# Altium schematic sheet ISOLATED_PS.SchDoc: AI ARTIQ Driver
size 420 x 297 mm; Author: G.Kasprowicz; CompanyName: CTI; Organization: CTI; Address1: CTI; Address2: Nowowiejska 15/19 00-665 Warsaw; Address3: gkasprow@gmail.com; DocumentNumber: 5; Revision: 1.0; SheetNumber: 5; SheetTotal: 11; ModifiedBy: -; CheckedDate: -; Title2: ISOLATED PS; DivGrp: CTI; ModifiedDate: -; ProjectName: Sensor Box
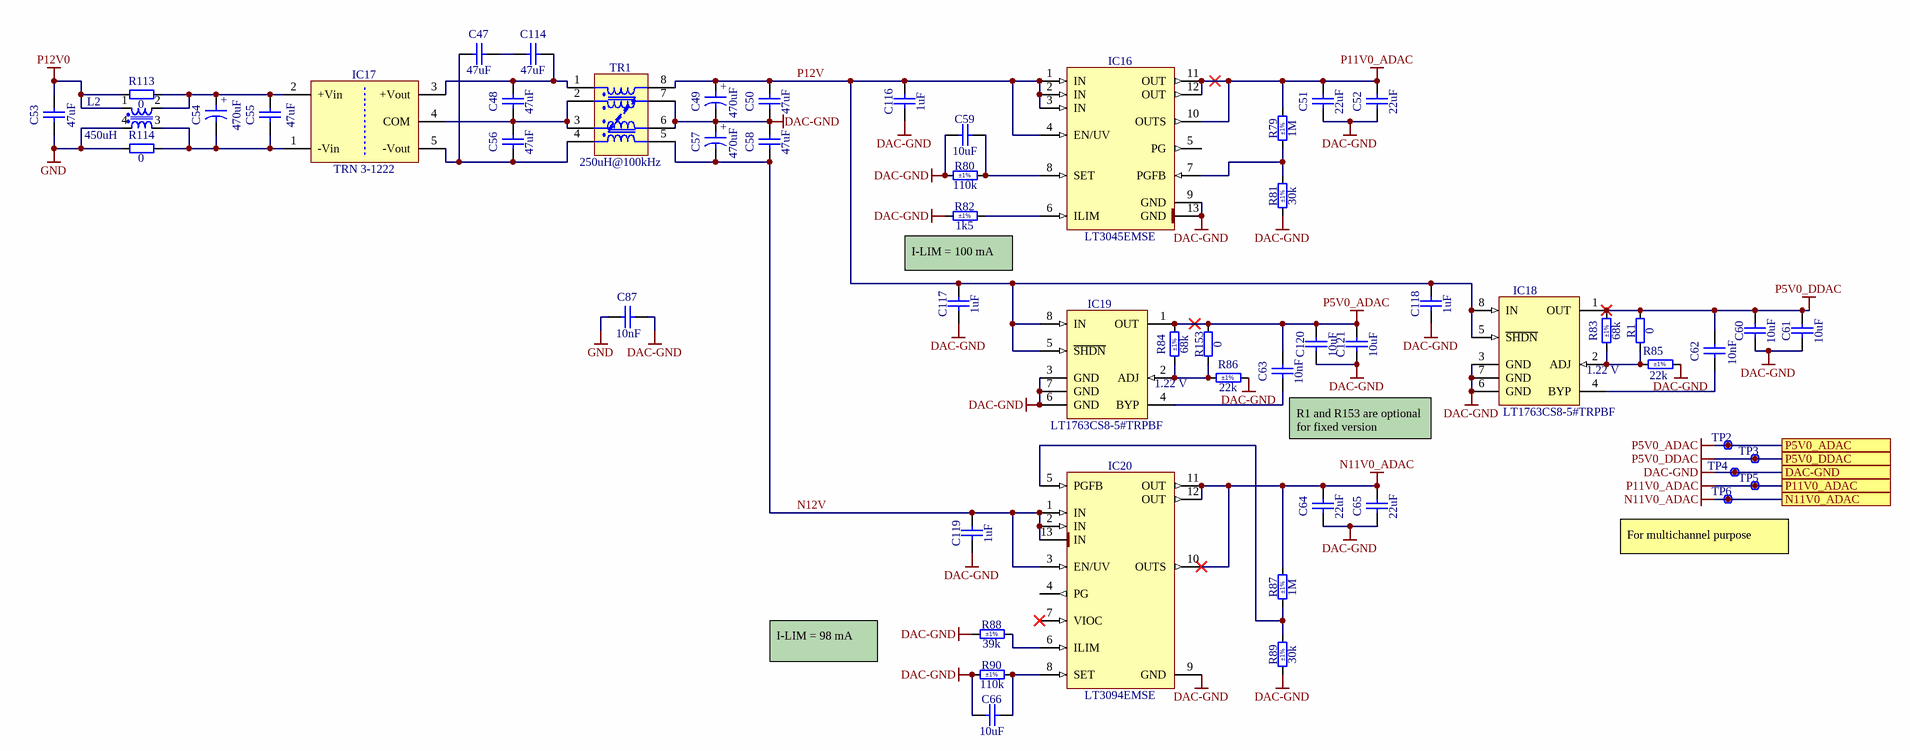
[diagram p0: ISOLATED_PS.SchDoc]

## Parts
C47  47uF  [CAPC3225X270N]
C48  47uF  [CAPC3225X270N]
C49  470uF  [CAPAE1030X1020N]
C50  47uF  [CAPC3225X270N]
C51  22uF  [CAPC3216X180N]
C52  22uF  [CAPC3216X180N]
C53  47uF  [CAPC3225X270N]
C54  470uF  [CAPAE1030X1020N]
C55  47uF  [CAPC3225X270N]
C56  47uF  [CAPC3225X270N]
C57  470uF  [CAPAE1030X1020N]
C58  47uF  [CAPC3225X270N]
C59  10uF  [CAPC2012X135N]
C60  10uF  [CAPC2012X135N]
C61  10uF  [CAPC2012X135N]
C62  10nF  [CAPC1608X87N]
C63  10nF  [CAPC1608X87N]
C64  22uF  [CAPC3216X180N]
C65  22uF  [CAPC3216X180N]
C66  10uF  [CAPC2012X135N]
C87  10nF  [CAPC1608X87N]
C114  47uF  [CAPC3225X270N]
C116  1uF  [CAPC1005X55N]
C117  1uF  [CAPC1005X55N]
C118  1uF  [CAPC1005X55N]
C119  1uF  [CAPC1005X55N]
C120  10uF  [CAPC2012X135N]
C121  10uF  [CAPC2012X135N]
IC16  LT3045EMSE  [SOP65P490X110-13N-R175X294]
IC17  TRN 3-1222  [DCDC_TRACO_TRN3]
IC18  LT1763CS8-5#TRPBF  [SOIC127P600X175-8N]
IC19  LT1763CS8-5#TRPBF  [SOIC127P600X175-8N]
IC20  LT3094EMSE  [SOP65P490X110-13N-R175X294]
L2  450uH  [CMDC-9260-6500]
R1  0  [RESC1608X55N]
R79  1M  Tolerance: ±1%  [RESC1005X40N]
R80  110k  Tolerance: ±1%  [RESC1005X40N]
R81  30k  Tolerance: ±1%  [RESC1005X40N]
R82  1k5  Tolerance: ±1%  [RESC1005X40N]
R83  68k  Tolerance: ±1%  [RESC1608X55N]
R84  68k  Tolerance: ±1%  [RESC1608X55N]
R85  22k  Tolerance: ±1%  [RESC1608X55N]
R86  22k  Tolerance: ±1%  [RESC1608X55N]
R87  1M  Tolerance: ±1%  [RESC1005X40N]
R88  39k  Tolerance: ±1%  [RESC1005X40N]
R89  30k  Tolerance: ±1%  [RESC1005X40N]
R90  110k  Tolerance: ±1%  [RESC1005X40N]
R113  0  [RESC2012X60N]
R114  0  [RESC2012X60N]
R153  0  [RESC1608X55N]
TP2  Test Point  [TPS127]  (value not drawn)  (no BOM)
TP3  Test Point  [TPS127]  (value not drawn)  (no BOM)
TP4  Test Point  [VERO_20-313145]  (value not drawn)
TP5  Test Point  [TPS127]  (value not drawn)  (no BOM)
TP6  Test Point  [TPS127]  (value not drawn)  (no BOM)
TR1  250uH@100kHz  [IND_WURTH_WE-SL_74420]

## Ports
DAC-GND, N11V0_ADAC, P5V0_ADAC, P5V0_DDAC, P11V0_ADAC

## Nets
DAC-GND: C49.2 C50.1 C51.1 C52.1 C57.1 C58.2 C59.1 C60.1 C61.1 C64.1 C65.1 C66.1 C87.2 C116.1 C117.1 C118.1 C119.1 C120.1 C121.1 IC16.9(GND) IC16.13(GND) IC18.3(GND) IC18.6(GND) IC18.7(GND) IC19.3(GND) IC19.6(GND) IC19.7(GND) IC20.9(GND) R80.1 R81.1 R82.1 R85.1 R86.1 R88.1 R89.1 R90.1 TP4.1 TR1.6 TR1.7 ; port DAC-GND
GND: C53.2 C87.1 L2.4 R114.1
N11V0_ADAC: C64.2 C65.2 IC20.10(OUTS) IC20.11(OUT) IC20.12(OUT) R87.2 TP6.1 ; port N11V0_ADAC
P5V0_ADAC: C63.2 C120.2 C121.2 IC19.1(OUT) R84.2 R153.2 TP2.1 ; port P5V0_ADAC
P5V0_DDAC: C60.2 C61.2 C62.2 IC18.1(OUT) R1.2 R83.2 TP3.1 ; port P5V0_DDAC
P11V0_ADAC: C51.2 C52.2 IC16.10(OUTS) IC16.11(OUT) IC16.12(OUT) R79.2 TP5.1 ; port P11V0_ADAC
P12V0: C53.1 L2.1 R113.1
N12V: C57.2 C58.1 C119.2 IC20.1(IN) IC20.2(IN) IC20.3(EN/UV) IC20.13(IN) TR1.5
P12V: C49.1 C50.2 C116.2 C117.2 C118.2 IC16.1(IN) IC16.2(IN) IC16.3(IN) IC16.4(EN/UV) IC18.5(~{SHDN}) IC18.8(IN) IC19.5(~{SHDN}) IC19.8(IN) TR1.8
NetC47_1: C47.1 C56.1 IC17.5(-Vout) TR1.4
NetC47_2: C47.2 C114.1
NetC48_1: C48.1 C56.2 IC17.4(COM) TR1.2 TR1.3
NetC48_2: C48.2 C114.2 IC17.3(+Vout) TR1.1(NC)
NetC54_1: C54.1 C55.1 IC17.2(+Vin) L2.2 R113.2
NetC54_2: C54.2 C55.2 IC17.1(-Vin) L2.3 R114.2
NetC59_2: C59.2 IC16.8(SET) R80.2
NetC62_1: C62.1 IC18.4(BYP)
NetC63_1: C63.1 IC19.4(BYP)
NetC66_2: C66.2 IC20.8(SET) R90.2
NetIC16_6: IC16.6(ILIM) R82.2
NetIC16_7: IC16.7(PGFB) R79.1 R81.2
NetIC18_2: IC18.2(ADJ) R1.1 R83.1 R85.2
NetIC19_2: IC19.2(ADJ) R84.1 R86.2 R153.1
NetIC20_5: IC20.5(PGFB) R87.1 R89.2
NetIC20_6: IC20.6(ILIM) R88.2

Not connected (* = marked no-connect by the designer): IC16 5(PG); IC20 4(PG) 7(VIOC)*

## Notes on the sheet
- I-LIM = 100 mA
- (near IC19) 1.22 V
- (near IC18) 1.22 V
- (near C63) R1 and R153 are optional for fixed version
- For multichannel purpose
- I-LIM = 98 mA
- Project/Equipment
- Document
- Designer
- Drawn by
- Check.by
- Copyright 2018.
  This documentation describes Open Hardware and is licensed under the CERN OHL v.1.1. You may redistribute and modify this documentation under the terms of the CERN OHL v.1.1. (http://ohwr.org/CERNOHL). This documentation is distributed WITHOUT ANY EXPRESS OR IMPLIED WARRANTY, INCLUDING OF MERCHANTABILITY, SATISFACTORY QUALITY AND FITNESS FOR A PARTICULAR PURPOSE. Please see the CERN OHL v.1.1 for applicable conditions.
- Contact
- File
- Last Mod.
- Print Date
- Sheet
- Size
- A3
- of
- Rev
- (in symbol CAE1030-1020_470UF_25V_20%) +

## Library data of the parts
C47 C48 C50 C53 C55 C56 C58 C114 = CC1210_47UF_16V_20%_X5R: Non-polarised capacitor; Part Description: SMD Multilayer Chip Ceramic Capacitor; Manufacturer: GENERIC; Manufacturer1 Part Number: EMK325BJ476MM-T; Voltage: 16V; TC: X5R; Tolerance: ±20%; Part Number: CC1210_47UF_16V_20%_X5R; Component Kind: Standard; Component Type: Standard; Pin Count: 2; Value: 47uF; Status: None; Manufacturer Part Number: CC1210_47UF_16V_20%_X5R; Case: 1210; Mounted: Yes; Socket: No; SMD: Yes; Sense: No; Manufacturer1 Example: TAIYO YUDEN; Manufacturer1 ComponentHeight: 2.7mm; HelpURL: \\cern.ch\dfs\Applications\Altium\Datasheets\CC1210_X5R_TAIYO-YUDEN_HIGH-VALUE.pdf; Author: CERN DEM MR; CreateDate: 03.02.2016; LatestRevisionDate: 03.02.2016
C49 C54 C57 = CAE1030-1020_470UF_25V_20%: Polarised capacitor; Part Description: Aluminum Electrolytic SMT Capacitor; Manufacturer: PANASONIC; Manufacturer Part Number: EEEFK1E471AP; Voltage: 25V; Tolerance: ±20%; Part Number: CAE1030-1020_470UF_25V_20%; Component Kind: Standard; Component Type: Standard; Pin Count: 2; Value: 470uF; Status: Not Recommended; Case: G; Mounted: Yes; Socket: No; SMD: Yes; Sense: No; ComponentHeight: 10.2mm; HelpURL: \\cern.ch\dfs\Applications\Altium\Datasheets\CAE_PANASONIC_FK-V.pdf; Author: CERN DEM JLC; CreateDate: 03.12.2007; LatestRevisionDate: 05.11.2014
C51 C52 C64 C65 = CC1206_22UF_35V_20%_JB_TDK_C3216JB1V226M160AC: Non-polarised capacitor; Part Description: SMD Multilayer Chip Ceramic Capacitor; Manufacturer: TDK; Voltage: 35V; TC: JB(±10%); Tolerance: ±20%; Part Number: CC1206_22UF_35V_20%_JB_TDK_C3216JB1V226M160AC; Component Kind: Standard; Component Type: Standard; Pin Count: 2; Value: 22uF; Status: None; Manufacturer Part Number: C3216JB1V226M160AC; Case: 1206; Mounted: Yes; Socket: No; SMD: Yes; Sense: No; ComponentHeight: 1.8mm; HelpURL: \\cern.ch\dfs\Applications\Altium\Datasheets\CC1206_TDK_C3216JB1V226M160AC.pdf; Author: CERN DEM JLC; CreateDate: 13.07.2017; LatestRevisionDate: 13.07.2017
C59-C61 C66 C120 C121 = CC0805_10UF_16V_10%_X5R: Non-polarised capacitor; Part Description: SMD Multilayer Chip Ceramic Capacitor; Manufacturer: GENERIC; Manufacturer1 Part Number: C0805C106K4PAC; Voltage: 16V; TC: X5R; Tolerance: ±10%; Part Number: CC0805_10UF_16V_10%_X5R; Component Kind: Standard; Component Type: Standard; Pin Count: 2; Value: 10uF; Status: Preferred; Manufacturer Part Number: CC0805_10UF_16V_10%_X5R; Case: 0805; Mounted: Yes; Socket: No; SMD: Yes; Sense: No; Manufacturer1 Example: KEMET; Manufacturer1 ComponentHeight: 1.4mm; HelpURL: \\cern.ch\dfs\Applications\Altium\Datasheets\CC1206_X5R_KEMET.pdf; Author: CERN DEM JLC; CreateDate: 03.12.2007; LatestRevisionDate: 03.12.2007
C62 C63 C87 = CC0603_10NF_50V_5%_C0G: Non-polarised capacitor; Part Description: SMD Multilayer Chip Ceramic Capacitor; Manufacturer: GENERIC; Manufacturer1 Part Number: C1608C0G1H103J080AA; Voltage: 50V; TC: C0G/NP0; Tolerance: ±5%; Part Number: CC0603_10NF_50V_5%_C0G; Component Kind: Standard; Component Type: Standard; Pin Count: 2; Value: 10nF; Status: Preferred; Manufacturer Part Number: CC0603_10NF_50V_5%_C0G; Case: 0603; Mounted: Yes; Socket: No; SMD: Yes; Sense: No; Manufacturer1 Example: TDK; Manufacturer1 ComponentHeight: 0.9mm; HelpURL: \\cern.ch\dfs\Applications\Altium\Datasheets\CC0603_C0G_TDK_C.pdf; Author: CERN DEM JLC; CreateDate: 10.12.2014; LatestRevisionDate: 10.12.2014
C116-C119 = CC0402_1UF_16V_10%_X5R: Non-polarised capacitor; Part Description: SMD Multilayer Chip Ceramic Capacitor; Manufacturer: GENERIC; Manufacturer1 Part Number: C1005X5R1C105KT; Voltage: 16V; TC: X5R; Tolerance: ±10%; Part Number: CC0402_1UF_16V_10%_X5R; Component Kind: Standard; Component Type: Standard; Pin Count: 2; Value: 1uF; Status: Preferred; Manufacturer Part Number: CC0402_1UF_16V_10%_X5R; Case: 0402; Mounted: Yes; Socket: No; SMD: Yes; Sense: No; Manufacturer1 Example: TDK; Manufacturer1 ComponentHeight: 0.55mm; HelpURL: \\cern.ch\dfs\Applications\Altium\Datasheets\CC0402_X5R_TDK_C.pdf; Author: CERN DEM JLC; CreateDate: 25.10.2012; LatestRevisionDate: 25.10.2012
IC16 = LT3045EMSE: 20V, 500mA, Ultralow Noise, Ultrahigh PSRR Linear Regulator; Manufacturer: LINEAR TECHNOLOGY; PressFit: No; Bonding: No; Part Number: LT3045EMSE; Component Kind: Standard; Component Type: Standard; Device: LT3045EMSE; PackageDescription: SOP, 0.65mm Pitch; 12 Pin, 3.00mm W X 4.039mm L X 1.10mm H body (w/Thermal Tab 1.75 X 2.94 mm), IPC Medium Density; Part Description: 20V, 500mA, Ultralow Noise, Ultrahigh PSRR Linear Regulator; Manufacturer Part Number: LT3045EMSE; Pin Count: 13; Case: MSOP12; Mounted: Yes; Socket: No; SMD: Yes; Sense: No; ComponentHeight: 1.1mm; HelpURL: \\cern.ch\dfs\Applications\Altium\Datasheets\LT3045.pdf; Author: CERN DEM HF; CreateDate: 18.05.2022; LatestRevisionDate: 18.05.2022
IC17 = TRN 3-1222: TRACO, TRN 3 Serie, Dual Output DCDC Converter; Part Description: 9-18VDC to ±12V, Iout (max) ±125mA, 3W DC-DC Converter; Manufacturer: TRACO POWER; PressFit: No; Bonding: No; Part Number: TRN 3-1222; Component Kind: Standard; Component Type: Standard; Device: TRN 3-1222; PackageDescription: TRN 3 Series , Body 11.9 x 7.7mm; Manufacturer Part Number: TRN 3-1222; Pin Count: 5; Mounted: Yes; Socket: No; SMD: No; Sense: No; ComponentHeight: 11.5mm; HelpURL: \\cern.ch\dfs\Applications\Altium\Datasheets\TRN 3-1222.pdf; Author: CERN DEM JLC; CreateDate: 06.06.2017; LatestRevisionDate: 06.06.2017
IC18 IC19 = LT1763CS8: 1.22V to 20V 500mA, Low Noise, LDO Adjustable Micropower Regulator; Part Description: 1.22V to 20V, 500mA, Low Noise, LDO Adjustable Micropower Regulator; Manufacturer: LINEAR TECHNOLOGY; PressFit: No; Bonding: No; Part Number: LT1763CS8; Component Kind: Standard; Component Type: Standard; Device: LT1763CS8; PackageDescription: SOIC 8, Pitch 1.27mm, Body 4x5mm, IPC Medium Density; Manufacturer Part Number: LT1763CS8; Pin Count: 8; Case: SOIC8; Mounted: Yes; Socket: No; SMD: Yes; Sense: No; ComponentHeight: 1.75mm; HelpURL: \\cern.ch\dfs\Applications\Altium\Datasheets\LT1763CS8#PBF.pdf; Author: CERN DEM JLC; CreateDate: 11.01.2010; LatestRevisionDate: 16.03.2021
IC20 = LT3094EMSE#PBF: -20V, 500mA, Ultralow Noise, Ultrahigh PSRR Negative Linear Regulator; Manufacturer: LINEAR TECHNOLOGY; PressFit: No; Bonding: No; Part Number: LT3094EMSE#PBF; Component Kind: Standard; Component Type: Standard; Device: LT3094EMSE; PackageDescription: SOP, 0.65mm Pitch; 12 Pin, 3.00mm W X 4.039mm L X 1.10mm H body (w/Thermal Tab 1.75 X 2.94 mm), IPC Medium Density; Part Description: -20V, 500mA, Ultralow Noise, Ultrahigh PSRR Negative Linear Regulator; Manufacturer Part Number: LT3094EMSE#PBF; Pin Count: 13; Case: MSOP12; Mounted: Yes; Socket: No; SMD: Yes; Sense: No; ComponentHeight: 1.1mm; HelpURL: \\cern.ch\dfs\Applications\Altium\Datasheets\LT3094EMSE#PBF.pdf; Author: CERN DEM JLC; CreateDate: 12.11.2018; LatestRevisionDate: 12.11.2018
L2 = IND_450UH_35%_TRACO_TCK-048: Inductor Common Mode; Part Description: Common Mode Choke TCK-048; Manufacturer: TRACO POWER; Power: 5.2A; Resistance: 0.025R; Tolerance: ±35%; Part Number: IND_450UH_35%_TRACO_TCK-048; Component Kind: Standard; Component Type: Standard; Footprint: IND_TRACO_TCK-048; Pin Count: 4; Value: 450uH; Manufacturer Part Number: TCK-048; Mounted: Yes; Socket: No; SMD: No; Sense: No; ComponentHeight: 9.8mm; HelpURL: \\cern.ch\dfs\Applications\Altium\Datasheets\IND_TRACO_TCK-048.pdf; Author: CERN DEM MR; CreateDate: 28.01.2016; LatestRevisionDate: 03.10.2019
R1 R153 = R0603_0R_JUMPER: Resistor; Part Description: 1A (0.05R Max DC Resistance) Zero Ohm Jumper; Manufacturer: GENERIC; Manufacturer1 Part Number: NRC06Z0; PressFit: No; Part Number: R0603_0R_JUMPER; Component Kind: Standard; Component Type: Standard; Pin Count: 2; Value: 0; Status: Preferred; Manufacturer Part Number: R0603_0R_JUMPER; Case: 0603; Mounted: Yes; Sense: No; Socket: No; SMD: Yes; Manufacturer1 Example: NIC COMPONENT; Manufacturer1 ComponentHeight: 0.55mm; HelpURL: \\cern.ch\dfs\Applications\Altium\Datasheets\R0603_NIC_NRC.pdf; Author: CERN DEM JLC; CreateDate: 03.12.2007; LatestRevisionDate: 13.03.2008
R79 R87 = R0402_1M_1%_0.0625W_100PPM: Resistor - 1%; Part Description: General Purpose Thick Film Chip Resistor; Manufacturer: GENERIC; Manufacturer1 Part Number: 232270671005L; TC: ±100ppm/°C; PressFit: No; Part Number: R0402_1M_1%_0.0625W_100PPM; Component Kind: Standard; Component Type: Standard; Pin Count: 2; Value: 1M; Status: Not Recommended; Power: 0.0625W; Manufacturer Part Number: R0402_1M_1%_0.0625W_100PPM; Case: 0402; Mounted: Yes; Sense: No; Socket: No; SMD: Yes; Manufacturer1 Example: YAGEO PHYCOMP; Manufacturer1 ComponentHeight: 0.4mm; HelpURL: \\cern.ch\dfs\Applications\Altium\Datasheets\R0402_Phycomp_RC0402.pdf; Author: CERN DEM JLC; CreateDate: 03.12.2007; LatestRevisionDate: 17.10.2012
R80 R90 = R0402_110K_1%_0.0625W_100PPM: Resistor - 1%; Part Description: General Purpose Thick Film Chip Resistor; Manufacturer: GENERIC; Manufacturer1 Part Number: 232270671104L; TC: ±100ppm/°C; PressFit: No; Part Number: R0402_110K_1%_0.0625W_100PPM; Component Kind: Standard; Component Type: Standard; Pin Count: 2; Value: 110k; Status: Not Recommended; Power: 0.0625W; Manufacturer Part Number: R0402_110K_1%_0.0625W_100PPM; Case: 0402; Mounted: Yes; Sense: No; Socket: No; SMD: Yes; Manufacturer1 Example: YAGEO PHYCOMP; Manufacturer1 ComponentHeight: 0.4mm; HelpURL: \\cern.ch\dfs\Applications\Altium\Datasheets\R0402_Phycomp_RC0402.pdf; Author: CERN DEM JLC; CreateDate: 03.12.2007; LatestRevisionDate: 17.10.2012
R81 R89 = R0402_30K_1%_0.0625W_100PPM: Resistor - 1%; Part Description: General Purpose Thick Film Chip Resistor; Manufacturer: GENERIC; Manufacturer1 Part Number: 232270673003L; TC: ±100ppm/°C; PressFit: No; Part Number: R0402_30K_1%_0.0625W_100PPM; Component Kind: Standard; Component Type: Standard; Pin Count: 2; Value: 30k; Status: Not Recommended; Power: 0.0625W; Manufacturer Part Number: R0402_30K_1%_0.0625W_100PPM; Case: 0402; Mounted: Yes; Sense: No; Socket: No; SMD: Yes; Manufacturer1 Example: YAGEO PHYCOMP; Manufacturer1 ComponentHeight: 0.4mm; HelpURL: \\cern.ch\dfs\Applications\Altium\Datasheets\R0402_Phycomp_RC0402.pdf; Author: CERN DEM JLC; CreateDate: 03.12.2007; LatestRevisionDate: 17.10.2012
R82 = R0402_1K5_1%_0.0625W_100PPM: Resistor - 1%; Part Description: General Purpose Thick Film Chip Resistor; Manufacturer: GENERIC; Manufacturer1 Part Number: 232270671502L; TC: ±100ppm/°C; PressFit: No; Part Number: R0402_1K5_1%_0.0625W_100PPM; Component Kind: Standard; Component Type: Standard; Pin Count: 2; Value: 1k5; Status: Not Recommended; Power: 0.0625W; Manufacturer Part Number: R0402_1K5_1%_0.0625W_100PPM; Case: 0402; Mounted: Yes; Sense: No; Socket: No; SMD: Yes; Manufacturer1 Example: YAGEO PHYCOMP; Manufacturer1 ComponentHeight: 0.4mm; HelpURL: \\cern.ch\dfs\Applications\Altium\Datasheets\R0402_Phycomp_RC0402.pdf; Author: CERN DEM JLC; CreateDate: 03.12.2007; LatestRevisionDate: 17.10.2012
R83 R84 = R0603_68K_1%_0.1W_100PPM: Resistor - 1%; Part Description: General Purpose Thick Film Chip Resistor; Manufacturer: GENERIC; Manufacturer1 Part Number: NRC06F6802TRF; Power: 0.1W; TC: ±100ppm/°C; PressFit: No; Part Number: R0603_68K_1%_0.1W_100PPM; Component Kind: Standard; Component Type: Standard; Pin Count: 2; Value: 68k; Status: Preferred; Manufacturer Part Number: R0603_68K_1%_0.1W_100PPM; Case: 0603; Mounted: Yes; Sense: No; Socket: No; SMD: Yes; Manufacturer1 Example: NIC COMPONENT; Manufacturer1 ComponentHeight: 0.55mm; HelpURL: \\cern.ch\dfs\Applications\Altium\Datasheets\R0603_NIC_NRC.pdf; Author: CERN DEM JLC; CreateDate: 03.12.2007; LatestRevisionDate: 13.03.2008
R85 R86 = R0603_22K_1%_0.1W_100PPM: Resistor - 1%; Part Description: General Purpose Thick Film Chip Resistor; Manufacturer: GENERIC; Manufacturer1 Part Number: NRC06F2202TRF; Power: 0.1W; TC: ±100ppm/°C; PressFit: No; Part Number: R0603_22K_1%_0.1W_100PPM; Component Kind: Standard; Component Type: Standard; Pin Count: 2; Value: 22k; Status: Preferred; Manufacturer Part Number: R0603_22K_1%_0.1W_100PPM; Case: 0603; Mounted: Yes; Sense: No; Socket: No; SMD: Yes; Manufacturer1 Example: NIC COMPONENT; Manufacturer1 ComponentHeight: 0.55mm; HelpURL: \\cern.ch\dfs\Applications\Altium\Datasheets\R0603_NIC_NRC.pdf; Author: CERN DEM JLC; CreateDate: 03.12.2007; LatestRevisionDate: 13.03.2008
R88 = R0402_39K_1%_0.0625W_100PPM: Resistor - 1%; Part Description: General Purpose Thick Film Chip Resistor; Manufacturer: GENERIC; Manufacturer1 Part Number: 232270673903; TC: ±100ppm/°C; PressFit: No; Part Number: R0402_39K_1%_0.0625W_100PPM; Component Kind: Standard; Component Type: Standard; Pin Count: 2; Value: 39k; Status: Not Recommended; Power: 0.0625W; Manufacturer Part Number: R0402_39K_1%_0.0625W_100PPM; Case: 0402; Mounted: Yes; Sense: No; Socket: No; SMD: Yes; Manufacturer1 Example: YAGEO PHYCOMP; Manufacturer1 ComponentHeight: 0.4mm; HelpURL: \\cern.ch\dfs\Applications\Altium\Datasheets\R0402_Phycomp_RC0402.pdf; Author: CERN DEM JLC; CreateDate: 03.12.2007; LatestRevisionDate: 17.10.2012
R113 R114 = R0805_0R_JUMPER: Resistor; Part Description: 2A (0.05R Max DC Resistance) Zero Ohm Jumper; Manufacturer: GENERIC; Manufacturer1 Part Number: NRC10Z0; PressFit: No; Part Number: R0805_0R_JUMPER; Component Kind: Standard; Component Type: Standard; Pin Count: 2; Value: 0; Status: Preferred; Manufacturer Part Number: R0805_0R_JUMPER; Case: 0805; Mounted: Yes; Sense: No; Socket: No; SMD: Yes; Manufacturer1 Example: NIC COMPONENT; Manufacturer1 ComponentHeight: 0.6mm; HelpURL: \\cern.ch\dfs\Applications\Altium\Datasheets\R0805_NIC_NRC.pdf; Author: CERN DEM JLC; CreateDate: 03.12.2007; LatestRevisionDate: 13.03.2008
TP2 TP3 TP5 TP6 = SMD_PAD_1.27X1.27MM: Part Description: 1.27mm x 1.27mm PCB Copper Area (SMD Test Point); Mounted: No; Part Number: SMD_PAD_1.27X1.27MM; Component Type: Standard (No BOM); Pin Count: 1; Family: Test Point; Socket: No; SMD: No; Sense: No; Status: None; ComponentHeight: 0mm; HelpURL: Undefined; Author: CERN DEM JLC; CreateDate: 12.01.2008; LatestRevisionDate: 12.01.2008; PackageDescription: 1.27mm x 1.27mm PCB Copper Area (SMD Test Point)
TP4 = VERO_20-313145: Part Description: Black Bead PCB Terminal Test Pin for 2.4mm PCB Thickness (1.32mm Hole); Manufacturer: VERO TECHNOLOGIES; PressFit: No; Part Number: VERO_20-313145; Component Kind: Standard; Component Type: Standard; Pin Count: 1; Family: Test Point; Mounted: Yes; Socket: No; SMD: No; Sense: No; Status: None; Manufacturer Part Number: 20-313145; ComponentHeight: 5.3mm; HelpURL: \\cern.ch\dfs\Applications\Altium\Datasheets\VERO_20-313145.pdf; Author: CERN DEM JLC; CreateDate: 15.07.2013; LatestRevisionDate: 15.07.2013
TR1 = IND_250UH_35%_WURTH_WE-SL_744204: Flyback Transformer; Part Description: 4 Line Common Mode Choke Surface Mount 600mA DCR(WE-SL Series); Manufacturer: WURTH ELEKTRONIK; Manufacturer Part Number: 744204; Power: 600mA; Resistance: 0.12r; Tolerance: ±35%; Part Number: IND_250UH_35%_WURTH_WE-SL_744204; Component Kind: Standard; Component Type: Standard; Pin Count: 8; Value: 250uH@100kHz; Mounted: Yes; Socket: No; SMD: Yes; Sense: No; ComponentHeight: 5.7mm; HelpURL: \\cern.ch\dfs\Applications\Altium\Datasheets\WURTH_WE-SL_74420.pdf; Author: CERN DEM HF; CreateDate: 16.05.2022; LatestRevisionDate: 16.05.2022